# Altium schematic sheet Titan_Balancer_1.SchDoc: Titan_Balancer
size 411 x 289 mm; Origin: Eagle; Date: 5/25/2021 7:31:24 PM; SheetNumber: 2; Value: a; GateName_1: G$1; SymbolName_1: A3L-LOC; LibraryName: frames; DeviceSetName: A3L-LOC; Sheet: Sheet:
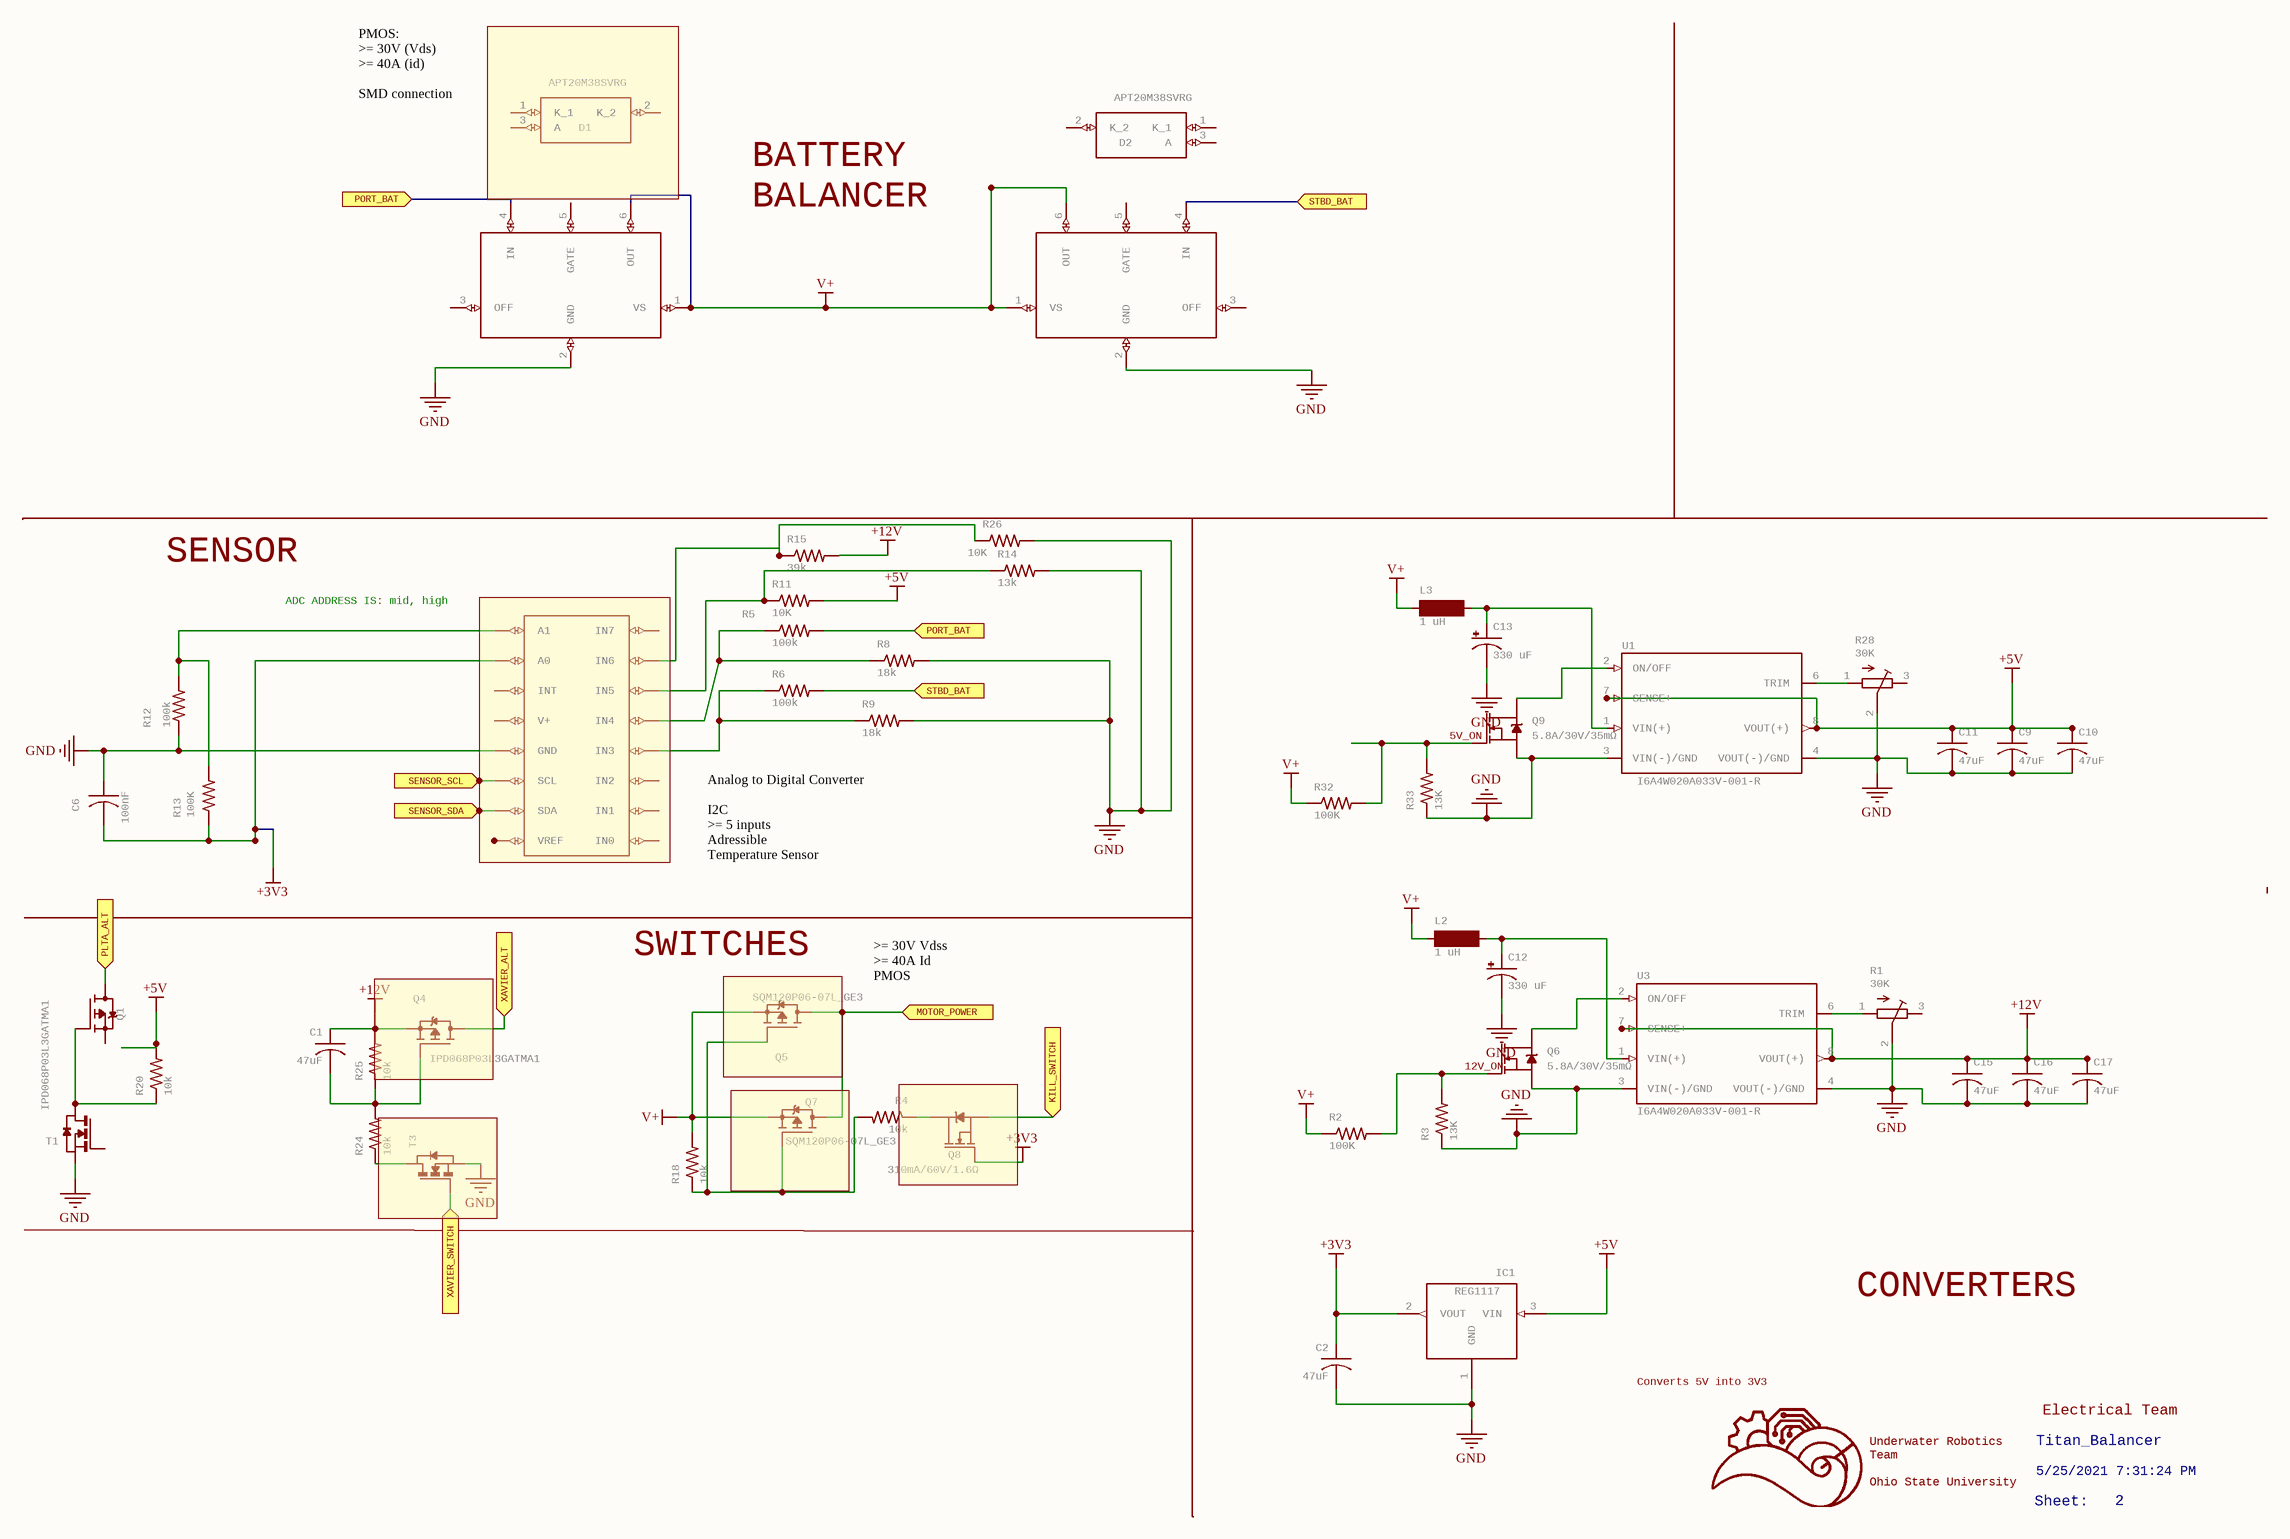
[diagram p0: Titan_Balancer_1.SchDoc]

## Parts
C1  47uF  [C0603]
C2  47uF  [C0603]
C6  100nF  [C0603]
C9  47uF  [C0603]
C10  47uF  [C0603]
C11  47uF  [C0603]
C12  330 uF  [153CLV-0810]
C13  330 uF  [153CLV-0810]
C15  47uF  [C0603]
C16  47uF  [C0603]
C17  47uF  [C0603]
D1  APT20M38SVRG  [APT60DQ60SG]
D2  APT20M38SVRG  [APT60DQ60SG]
IC1  REG1117  [SOT223]
L2  1 uH  [MS85]
L3  1 uH  [MS85]
Q1  IPD068P03L3GATMA1  [TO252]
Q4  IPD068P03L3GATMA1  [TO252]
Q5  SQM120P06-07L_GE3  [TO263]
Q6  5.8A/30V/35mΩ  [SOT23-3]
Q7  SQM120P06-07L_GE3  [TO263]
Q8  310mA/60V/1.6Ω  [SOT323]
Q9  5.8A/30V/35mΩ  [SOT23-3]
R1  30K  [RTRIM3103]
R2  100K  [R0603]
R3  13K  [R0603]
R4  10k  [R0603]
R5  100k  [R0603]
R6  100k  [R0603]
R8  18k  [R0603]
R9  18k  [R0603]
R11  10K  [R0603]
R12  100k  [R0603]
R13  100K  [R0603]
R14  13k  [R0603]
R15  39k  [R0603]
R18  10k  [R0603]
R20  10k  [R0603]
R24  10k  [R0603]
R25  10k  [R0603]
R26  10K  [R0603]
R28  30K  [RTRIM3103]
R32  100K  [R0603]
R33  13K  [R0603]
T1  NMOSSOT23  [SOT-23]  (value not drawn)
T3  NMOSSOT23  [SOT-23]  (value not drawn)
U1  I6A4W020A033V-001-R  [TDK-LAMBDA_I6A4W020A033V-001-R]
U3  I6A4W020A033V-001-R  [TDK-LAMBDA_I6A4W020A033V-001-R]
U$5  LM5050  [LM5050]  (value not drawn)
U$6  LM5050  [LM5050]  (value not drawn)
U$9  ADC128D818  [TSSOP-16]  (value not drawn)

## Ports
KILL_SWITCH (in), MOTOR_POWER (in), PLTA_ALT (in), PORT_BAT (in), SENSOR_SCL (in), SENSOR_SDA (in), STBD_BAT (in), XAVIER_ALT (in), XAVIER_SWITCH (in)

## Nets
+3V3: C2.1 C6.2 IC1.2(VOUT) Q8.1(G) R13.1 U$9.A0
+5V: C9.1 C10.1 C11.1 IC1.3(VIN) R11.2 R20.2 U1.7(SENSE+) U1.8(VOUT(+))
+12V: C1.1 C15.1 C16.1 C17.1 Q4.2(S) R15.2 R25.2 U3.7(SENSE+) U3.8(VOUT(+))
GND: C2.2 C6.1 C9.2 C10.2 C11.2 C12.- C13.- C15.2 C16.2 C17.2 IC1.1(GND) Q6.2(S) Q9.2(S) R1.2(S) R3.1 R8.2 R9.2 R12.1 R14.2 R26.2 R28.2(S) R33.1 T1.2(S) T3.2(S) U1.3(VIN(-)/GND) U1.4(VOUT(-)/GND) U3.3(VIN(-)/GND) U3.4(VOUT(-)/GND) U$5.2(GND) U$6.2(GND) U$9.GND
V+: L2.1 L3.1 Q5.2(S) Q7.2(S) R2.1 R18.2 R32.1 U$5.1(VS) U$5.6(OUT) U$6.1(VS) U$6.6(OUT)
5V_ON: Q9.1(G) R32.2 R33.2
12V_ON: Q6.1(G) R2.2 R3.2
KILL_SWITCH: Q8.2(S) ; port KILL_SWITCH
MOTOR_POWER: Q5.3(D) Q7.3(D) ; port MOTOR_POWER
PLTA_ALT: Q1.3(D) ; port PLTA_ALT
PORT_BAT: R5.2 U$5.4(IN) ; port PORT_BAT
SENSOR_SCL: U$9.SCL ; port SENSOR_SCL
SENSOR_SDA: U$9.SDA ; port SENSOR_SDA
STBD_BAT: R6.2 U$6.4(IN) ; port STBD_BAT
XAVIER_ALT: Q4.3(D) ; port XAVIER_ALT
XAVIER_SWITCH: T3.3(G) ; port XAVIER_SWITCH
NetC1_2: C1.2 Q4.1(G) R24.2 R25.1
NetC12_+: C12.+ L2.2 U3.1(VIN(+))
NetC13_+: C13.+ L3.2 U1.1(VIN(+))
NetQ1_1: Q1.1(G) R20.1 T1.1(D)
NetQ5_1: Q5.1(G) Q7.1(G) R4.2 R18.1
NetQ6_3: Q6.3(D) U3.2(ON/OFF)
NetQ8_3: Q8.3(D) R4.1
NetQ9_3: Q9.3(D) U1.2(ON/OFF)
NetR1_1: R1.1(A) U3.6(TRIM)
NetR5_1: R5.1 R8.1 U$9.IN4
NetR6_1: R6.1 R9.1 U$9.IN3
NetR11_1: R11.1 R14.1 U$9.IN5
NetR12_2: R12.2 R13.2 U$9.A1
NetR15_1: R15.1 R26.1 U$9.IN6
NetR24_1: R24.1 T3.1(D)
NetR28_1: R28.1(A) U1.6(TRIM)

Not connected (* = marked no-connect by the designer): D1 1(K_1) 2(K_2) 3(A); D2 1(K_1) 2(K_2) 3(A); Q1 2(S); R1 3(E); R28 3(E); T1 3(G); U$5 3(OFF) 5(GATE); U$6 3(OFF) 5(GATE); U$9 IN0 IN1 IN2 IN7 INT V+ VREF

## Notes on the sheet
- PMOS:
  >= 30V (Vds)
  >= 40A (id)
  SMD connection
- BATTERY
  BALANCER
- SENSOR
- ADC ADDRESS IS: mid, high
- Analog to Digital Converter
  I2C
  >= 5 inputs
  Adressible
  Temperature Sensor
- (near Q5) SWITCHES
- >= 30V Vdss
  >= 40A Id
  PMOS
- CONVERTERS
- (near IC1) Converts 5V into 3V3
- Titan_Balancer
- Electrical Team
- Underwater Robotics
  Team
  Ohio State University
- Sheet:
- 5/25/2021 7:31:24 PM
- 2

## Library data of the parts
C1 C2 C6 C9-C11 C15-C17 = C-USC0603: CAPACITOR, American symbol; GateName_1: G$1; SymbolName_1: C-US; POPULARITY: 37; DeviceName: C0603; LibraryName: rcl; DeviceSetName: C-US; SPICEPREFIX: C
C12 C13 = CPOL-US153CLV-0810: POLARIZED CAPACITOR, American symbol; GateName_1: G$1; POPULARITY: 3; SymbolName_1: CPOL-US; DeviceName: 153CLV-0810; LibraryName: rcl; DeviceSetName: CPOL-US; SPICEPREFIX: C
D1 D2 = APT60DQ60SG: Rectifiers FG, FRED, 600V, 60A, D3, TO-268, RoHS   Source:  Datasheet; MANUFACTURER_NAME: Microsemi Corporation; GateName_1: G$1; SymbolName_1: APT60DQ60SG; LibraryName: APT60DQ60SG; DeviceSetName: APT60DQ60SG; ARROW_PART_NUMBER: APT60DQ60SG; ARROW_PRICE-STOCK: ARROW_PRICE-STOCK; HEIGHT: 5.1mm; MANUFACTURER_PART_NUMBER: APT60DQ60SG; MOUSER_PART_NUMBER: 494-APT60DQ60SG; MOUSER_PRICE-STOCK: https://www.mouser.co.uk/ProductDetail/Microchip-Microsemi/APT60DQ60SG?qs=T3oQrply3y%2FxiTR%252BTuJEjQ%3D%3D
IC1 = REG1117: 800mA and 1A Low Dropout (LDO) Positive Regulator   1.8V, 2.5V, 2.85V, 3.3V, 5V, and Adj; GateName_1: G$1; SymbolName_1: REG1118; POPULARITY: 49; LibraryName: burr-brown; DeviceSetName: REG1117; MF: MF; MPN: REG1117; OC_FARNELL: 1097566; OC_NEWARK: 14P6981
L2 L3 = MS85: INDUCTOR   SMD power inductor; GateName_1: G$1; SymbolName_1: L; LibraryName: inductor-neosid; DeviceSetName: MS85; MF: MF; MPN: MPN; OC_FARNELL: unknown; OC_NEWARK: unknown
Q1 Q4 = SPD30P06PTO252: SIPMOS(R) Power-Transistor P-Channel, Enhancement mode   Source: http://www.infineon.com/upload/Document/cmc_upload/documents/012/3615/SPD_U30P06P.pdf; GateName_1: G$1; SymbolName_1: P-MOSFET; POPULARITY: 3; DeviceName: TO252; LibraryName: transistor-fet; DeviceSetName: SPD30P06P
Q5 Q7 = SPB80P06P: SIPMOS (R) Power-Transistor P-Channel, Enhancement mode   Source: http://www.infineon.com/upload/Document/cmc_upload/documents/011/3685/SPP80P06P.pdf; GateName_1: G$1; SymbolName_1: P-MOSFET; POPULARITY: 0; LibraryName: transistor-fet; DeviceSetName: SPB80P06P
Q6 Q9 = MOSFET-NCH-AO3404A: N-channel MOSFETs    Voltage controlled devices that allow control of high current outputs.   SparkFun Products: SparkFun OpenScale  SparkFun Digital Sandbox  SparkFun Monster Moto Shield  SparkFun MOSFET Power Controller; GateName_1: NMOS; SymbolName_1: LABELED-NMOS; PROD_ID: TRANS-12988; DeviceName: -AO3404A; LibraryName: SparkFun-DiscreteSemi; DeviceSetName: MOSFET-NCH
Q8 = MOSFET-NCH-2N7002PW: N-channel MOSFETs    Voltage controlled devices that allow control of high current outputs.   SparkFun Products: SparkFun OpenScale  SparkFun Digital Sandbox  SparkFun Monster Moto Shield  SparkFun MOSFET Power Controller; GateName_1: NMOS; SymbolName_1: LABELED-NMOS; PROD_ID: TRANS-11151; DeviceName: -2N7002PW; LibraryName: SparkFun-DiscreteSemi; DeviceSetName: MOSFET-NCH
R1 R28 = R-TRIMM3103: Trimm resistor; GateName_1: G$1; SymbolName_1: R-TRIM-1; DeviceName: 3103; LibraryName: resistor; DeviceSetName: R-TRIMM
R2-R6 R8 R9 R11-R15 R18 R20 R24-R26 R32 R33 = R-US_R0603: RESISTOR, American symbol; GateName_1: G$1; SymbolName_1: R-US; DeviceSetName: R-US_; POPULARITY: 77; DeviceName: R0603; LibraryName: rcl; SPICEPREFIX: R
T1 T3 = NMOSSOT23: MOS FET; GateName_1: A; SymbolName_1: N_MOSFET; POPULARITY: 5; LibraryName: zetex; DeviceSetName: NMOSSOT23; MF: MF; MPN: MPN; OC_FARNELL: unknown; OC_NEWARK: unknown
U1 U3 = I6A4W020A033V-001-R: Dc-Dc, Pcb Mount, Sixteenth Brick, Input 24vdc, Output 3.3-15v 20a, 250w, Neg Logic; GateName_1: G$1; MF: TDK-Lambda Americas; SymbolName_1: I6A4W020A033V-001-R; LibraryName: I6A4W020A033V-001-R; DeviceSetName: I6A4W020A033V-001-R; DIGI-KEY_PART_NUMBER: 285-2503-ND; MOUSER-PURCHASE-URL: https://snapeda.com/shop?store=Mouser&id=1737324; MP: I6A4W020A033V-001-R; PACKAGE: DIP-7 TDK-Lambda
U$5 U$6 = LM5050: GateName_1: G$1; SymbolName_1: LM5050; LibraryName: LM5050; DeviceSetName: LM5050
U$9 = ADC128D818: GateName_1: G$1; SymbolName_1: ADC128D818; LibraryName: ADC128D818; DeviceSetName: ADC128D818